# Altium project MC1_LCD.PrjPcb
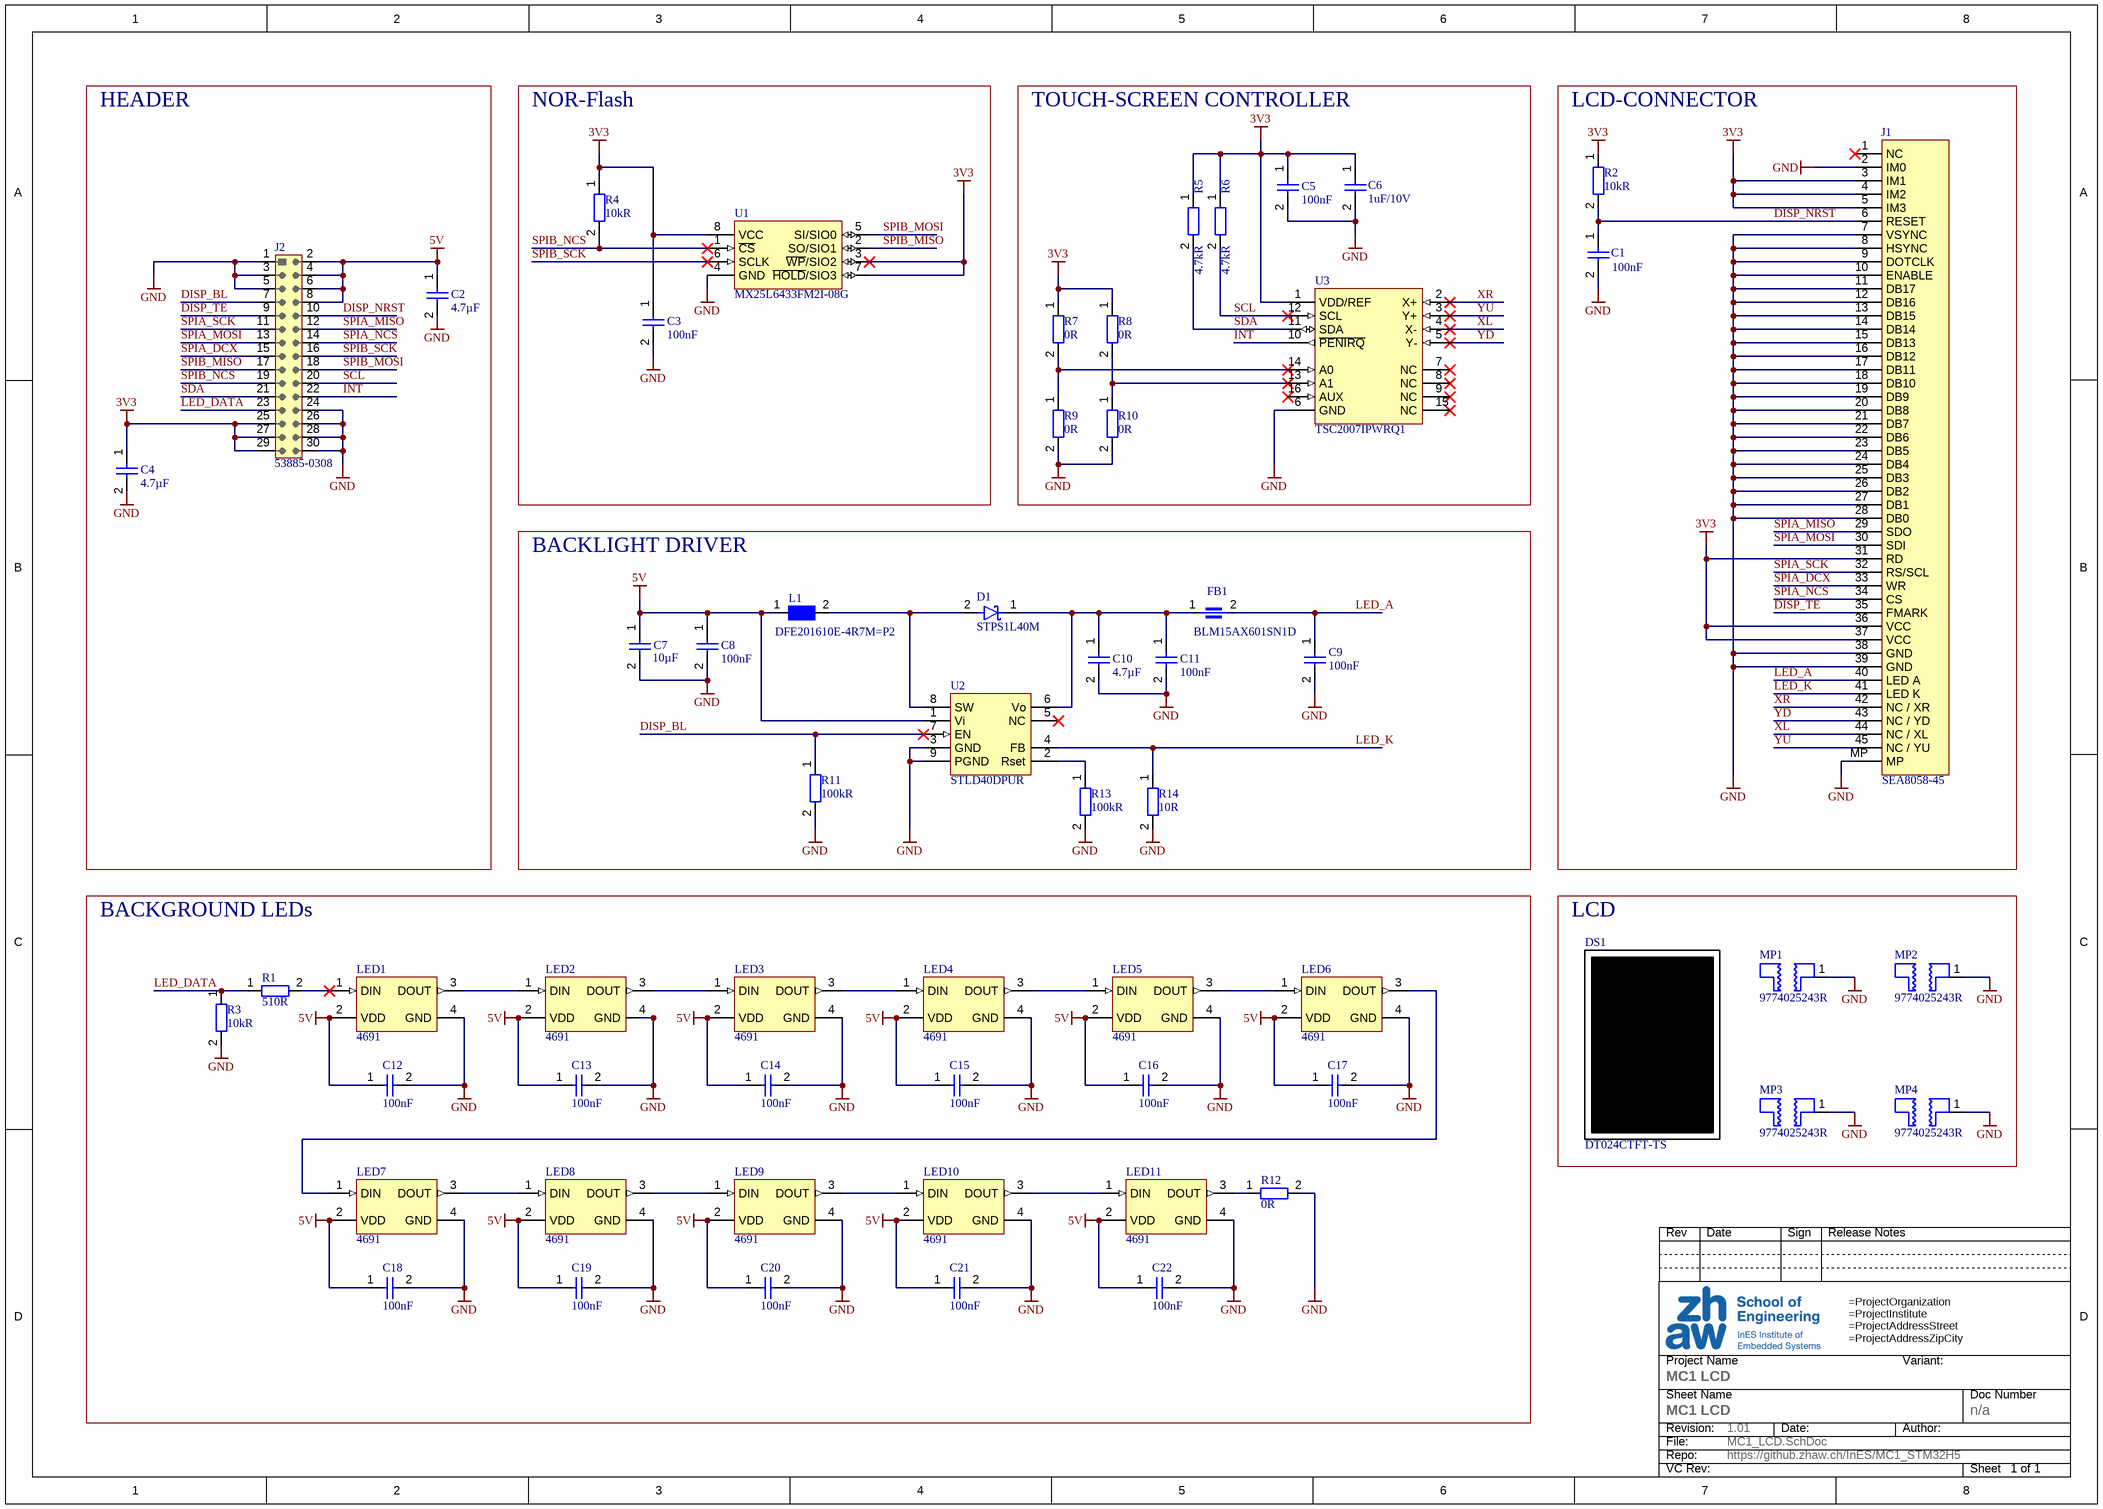
[diagram p0: MC1_LCD.SchDoc]
ProjectAddressStreet: Technikumstrasse 9; ProjectAddressZipCity: CH-8401 Winterthur; ProjectAuthor: frtt; ProjectInstitute: Institute of Embedded Systems; ProjectOrganization: Zurich University of Applied Sciences; ProjectPcbRevision: 1.01; ProjectProjectName: MC1 LCD; ProjectRepository: https://github.zhaw.ch/InES/MC1_STM32H5; ProjectSchematicDate: Can be used to set a manual schematic date. Set the value of the schematic document parameter DocumentDate to =ProjectSchematicDate; ProjectSchematicDocNo: n/a; ProjectSchematicRevision: 1.01; ProjectSchematicSheetNameCommon: Schematic
1 sheet, 60 parts. Net scope: global (net labels, ports and power ports of the same name join across sheets).
Board file: MC1_LCD.PcbDoc

## Sheet MC1_LCD.SchDoc
size A3; SheetNumber: 1; SheetTotal: 1; DocumentSheetName: MC1 LCD; DocumentAuthor: frtt

### Parts
C1  value 100nF  [CAPC1005X05L]  (hidden comment: 100nF/16V)
C2  value 4.7µF  [CAPC1608X80N]  (hidden comment: 4.7uF/16V)
C3  value 100nF  [CAPC1005X05L]  (hidden comment: 100nF/16V)
C4  value 4.7µF  [CAPC1608X80N]  (hidden comment: 4.7uF/16V)
C5  value 100nF  [CAPC1005X05L]  (hidden comment: 100nF/16V)
C6  1uF/10V  [CAPC1005X05L]
C7  value 10µF  [CAPC1608X80N]  (hidden comment: 10uF/10V)
C8  value 100nF  [CAPC1005X50N]  (hidden comment: 100nF/16V)
C9  value 100nF  [CAPC1005X50N]  (hidden comment: 100nF/16V)
C10  value 4.7µF  [CAPC1608X80N]  (hidden comment: 4.7uF/16V)
C11  value 100nF  [CAPC1005X50N]  (hidden comment: 100nF/16V)
C12  value 100nF  [CAPC1005X50N]  (hidden comment: 100nF/16V)
C13  value 100nF  [CAPC1005X50N]  (hidden comment: 100nF/16V)
C14  value 100nF  [CAPC1005X50N]  (hidden comment: 100nF/16V)
C15  value 100nF  [CAPC1005X50N]  (hidden comment: 100nF/16V)
C16  value 100nF  [CAPC1005X50N]  (hidden comment: 100nF/16V)
C17  value 100nF  [CAPC1005X50N]  (hidden comment: 100nF/16V)
C18  value 100nF  [CAPC1005X50N]  (hidden comment: 100nF/16V)
C19  value 100nF  [CAPC1005X50N]  (hidden comment: 100nF/16V)
C20  value 100nF  [CAPC1005X50N]  (hidden comment: 100nF/16V)
C21  value 100nF  [CAPC1005X50N]  (hidden comment: 100nF/16V)
C22  value 100nF  [CAPC1005X50N]  (hidden comment: 100nF/16V)
D1  STPS1L40M  [DIOM190190X100N]
DS1  DT024CTFT-TS  [LCD_DT024CTFT-TS]  (no BOM)
FB1  BLM15AX601SN1D  [INDC1005X05L]
J1  SEA8058-45  [DISPLAYTECH_SEA8058-45]
J2  53885-0308  [MOLEX_53885-0308]
L1  DFE201610E-4R7M=P2  [INDC2016X10L]
LED1  4691  [LED_SK68XX-SIDE]
LED2  4691  [LED_SK68XX-SIDE]
LED3  4691  [LED_SK68XX-SIDE]
LED4  4691  [LED_SK68XX-SIDE]
LED5  4691  [LED_SK68XX-SIDE]
LED6  4691  [LED_SK68XX-SIDE]
LED7  4691  [LED_SK68XX-SIDE]
LED8  4691  [LED_SK68XX-SIDE]
LED9  4691  [LED_SK68XX-SIDE]
LED10  4691  [LED_SK68XX-SIDE]
LED11  4691  [LED_SK68XX-SIDE]
MP1  9774025243R  [WE_9774025243R]
MP2  9774025243R  [WE_9774025243R]
MP3  9774025243R  [WE_9774025243R]
MP4  9774025243R  [WE_9774025243R]
R1  510R  [RESC1005X35N]
R2  10kR  [RESC1005X35N]
R3  10kR  [RESC1005X35N]
R4  10kR  [RESC1005X35N]
R5  4.7kR  [RESC1005X35N]
R6  4.7kR  [RESC1005X35N]
R7  0R  [RESC1005X35N]
R8  0R  [RESC1005X35N]
R9  0R  [RESC1005X35N]
R10  0R  [RESC1005X35N]
R11  100kR  [RESC1005X35N]
R12  0R  [RESC1005X35N]
R13  100kR  [RESC1005X35N]
R14  10R  [RESC1005X35N]
U1  MX25L6433FM2I-08G  [SOP127P800X210-8L]
U2  STLD40DPUR  [QFN65P300X300X100-9T274X190N]
U3  TSC2007IPWRQ1  [TSOP65P640X120-16L]

### Blocks framed on the sheet
HEADER: C2 C4 J2
NOR-Flash: C3 R4 U1
TOUCH-SCREEN CONTROLLER: C5 C6 R5-R10 U3
LCD-CONNECTOR: C1 J1 R2
BACKLIGHT DRIVER: C7-C11 D1 FB1 L1 R11 R13 R14 U2
BACKGROUND LEDs: C12-C22 LED1-LED11 R1 R3 R12
LCD: DS1 MP1-MP4

### Nets
3V3: C3.1 C4.1 C5.1 C6.1 J1.3(IM1) J1.4(IM2) J1.5(IM3) J1.31(RD) J1.36(VCC) J1.37(VCC) J2.25 J2.27 J2.29 R2.1 R4.1 R5.1 R6.1 R7.1 R8.1 U1.3(~{WP}/SIO2) U1.7(~{HOLD}/SIO3) U1.8(VCC) U3.1(VDD/REF)
5V: C2.1 C7.1 C8.1 C12.1 C13.1 C14.1 C15.1 C16.1 C17.1 C18.1 C19.1 C20.1 C21.1 C22.1 J2.2 J2.4 J2.6 J2.8 L1.1 LED1.2(VDD) LED2.2(VDD) LED3.2(VDD) LED4.2(VDD) LED5.2(VDD) LED6.2(VDD) LED7.2(VDD) LED8.2(VDD) LED9.2(VDD) LED10.2(VDD) LED11.2(VDD) U2.1(Vi)
GND: C1.2 C2.2 C3.2 C4.2 C5.2 C6.2 C7.2 C8.2 C9.2 C10.2 C11.2 C12.2 C13.2 C14.2 C15.2 C16.2 C17.2 C18.2 C19.2 C20.2 C21.2 C22.2 J1.2(IM0) J1.7(VSYNC) J1.8(HSYNC) J1.9(DOTCLK) J1.10(ENABLE) J1.11(DB17) J1.12(DB16) J1.13(DB15) J1.14(DB14) J1.15(DB13) J1.16(DB12) J1.17(DB11) J1.18(DB10) J1.19(DB9) J1.20(DB8) J1.21(DB7) J1.22(DB6) J1.23(DB5) J1.24(DB4) J1.25(DB3) J1.26(DB2) J1.27(DB1) J1.28(DB0) J1.38(GND) J1.39(GND) J1.MP J2.1 J2.3 J2.5 J2.24 J2.26 J2.28 J2.30 LED1.4(GND) LED2.4(GND) LED3.4(GND) LED4.4(GND) LED5.4(GND) LED6.4(GND) LED7.4(GND) LED8.4(GND) LED9.4(GND) LED10.4(GND) LED11.4(GND) MP1.1(Pad) MP2.1(Pad) MP3.1(Pad) MP4.1(Pad) R3.2 R9.2 R10.2 R11.2 R12.2 R13.2 R14.2 U1.4(GND) U2.3(GND) U2.9(PGND) U3.6(GND)
DISP_BL: J2.7 R11.1 U2.7(EN)
DISP_NRST: C1.1 J1.6(RESET) J2.10 R2.2
DISP_TE: J1.35(FMARK) J2.9
INT: J2.22 U3.10(~{PENIRQ})
LED_A: C9.1 FB1.2 J1.40(LED_A)
LED_DATA: J2.23 R1.1 R3.1
LED_K: J1.41(LED_K) R14.1 U2.4(FB)
SCL: J2.20 R6.2 U3.12(SCL)
SDA: J2.21 R5.2 U3.11(SDA)
SPIA_DCX: J1.33(WR) J2.15
SPIA_MISO: J1.29(SDO) J2.12
SPIA_MOSI: J1.30(SDI) J2.13
SPIA_NCS: J1.34(CS) J2.14
SPIA_SCK: J1.32(RS/SCL) J2.11
SPIB_MISO: J2.17 U1.2(SO/SIO1)
SPIB_MOSI: J2.18 U1.5(SI/SIO0)
SPIB_NCS: J2.19 R4.2 U1.1(~{CS})
SPIB_SCK: J2.16 U1.6(SCLK)
XL: J1.44(NC_/_XL) U3.4(X-)
XR: J1.42(NC_/_XR) U3.2(X+)
YD: J1.43(NC_/_YD) U3.5(Y-)
YU: J1.45(NC_/_YU) U3.3(Y+)
NetC10_1: C10.1 C11.1 D1.1(Cathode) FB1.1 U2.6(Vo)
NetD1_2: D1.2(Anode) L1.2 U2.8(SW)
NetLED1_1: LED1.1(DIN) R1.2
NetLED1_3: LED1.3(DOUT) LED2.1(DIN)
NetLED2_3: LED2.3(DOUT) LED3.1(DIN)
NetLED3_3: LED3.3(DOUT) LED4.1(DIN)
NetLED4_3: LED4.3(DOUT) LED5.1(DIN)
NetLED5_3: LED5.3(DOUT) LED6.1(DIN)
NetLED6_3: LED6.3(DOUT) LED7.1(DIN)
NetLED7_3: LED7.3(DOUT) LED8.1(DIN)
NetLED8_3: LED8.3(DOUT) LED9.1(DIN)
NetLED9_3: LED9.3(DOUT) LED10.1(DIN)
NetLED10_3: LED10.3(DOUT) LED11.1(DIN)
NetLED11_3: LED11.3(DOUT) R12.1
NetR7_2: R7.2 R9.1 U3.14(A0)
NetR8_2: R8.2 R10.1 U3.13(A1)
NetR13_1: R13.1 U2.2(Rset)

Not connected (* = marked no-connect by the designer): J1 1(NC)*; U2 5(NC)*; U3 7(NC)* 8(NC)* 9(NC)* 15(NC)* 16(AUX)*

### Notes on the sheet
- Rev
- Date
- Sign
- Release Notes
- Sheet Name
- Project Name
- Variant:
- Doc Number
- File:
- Repo:
- Revision:
- Date:
- Author:
- VC Rev:
- Sheet

### Library data of the parts
C1 C3 C5 C8 C9 C11-C22 = CMP-001-00001-22: Cap MLCC, 100nF, 16V, X7R, 5%,  0402; Dielectricum: X7R; Type: MLCC; Case Code (Metric): 1005; Voltage Rating: 16V; Case/Package: 0402; Mounting Technology: SMD; Tolerance: 5%
C2 C4 C10 = CMP-00443-4: Cap MLCC, 4.7uF, 16V, X7R, 10%, 0603; Voltage Rating: 16V; Mounting Technology: SMD; Tolerance: 10%; Case/Package: 0603; Type: MLCC; Case Code (Metric): 1608; Dielectricum: X7R
C6 = CMP-00269-6: CAP MLCC, 1uF, 10V, X7R, 10%, 0402; Value: 1µF; Type: MLCC; Mounting Technology: SMD; Voltage Rating: 10V; Case/Package: 0402; Tolerance: 10%; Case Code (Metric): 1005; Dielectricum: X7R
C7 = CMP-001-00075-19: Cap MLCC, 10uF, 10V, X5R, 10%, 0603; Mounting Technology: SMD; Type: MLCC; Case Code (Metric): 1608; Voltage Rating: 10V; Tolerance: 10%; Dielectricum: X5R; Case/Package: 0603
D1 = CMP-00907-3: Schottky Diode, 40V, 1A, DO-216AA; Size: L1.9B1.9H1; Mounting Technology: SMD; Voltage: 40V; Type: Schottky; Current: 1A; Case/Package: DO-216AA
DS1 = CMP-00784-22: Display, 2.5V..3.3V, 240x320px, Parallel/SPI, Touch: yes, Backlight: yes, FPC-45; Min Supply Voltage: 2.5V; Max Supply Voltage: 3.3V; Mounting Technology: SMD; Interface: Parallel/SPI; Size: L59.46B42.72H3.8; Case/Package: FPC-45; Backlight: yes; Resolution: 240x320; Touch: yes
FB1 = CMP-006-00058-7: Ferrite Bead, 340mR @ DC, 600R @ 100MHz, 25%, 0402, 500mA; Impedance DC: 0.34; Impedance: 600R @ 100 MHz; Tolerance: 25%; Case Code (Metric): 1005; Mounting Technology: SMD; Current: 500mA; Case/Package: 0402
J1 = CMP-00783-14: FFC/FPC, 45 Pin, Pitch 500um, 500mA, Horizontal, SMD, L28B4.2H2; Manufacturer: Displaytech - a SEACOMP company; Connection: Pluggable; Pin Mapping: 1x45; Pitch: 500µm; Gender: Female; Pins: 45; Max Current: 500mA; Angle: Horizontal; Type: FFC/FPC; Mounting Technology: SMD; Size: L28B4.2H2
J2 = CMP-00906-6: Board to Board, SlimStack, 2x15 Pin, Pitch 0.5mm, Male, 0.5A, 50V, Vertical, SMD, L8.95B2.9H1.48; Mating Part: 54102; Manufacturer: Molex; Pitch: 500µm; Max Current: 500mA; Connection: Pluggable; Mounting Technology: SMD; Family Name: SlimStack; Max Voltage: 50V; Gender: Male; Angle: Vertical; Pins: 30; Type: Board to Board; Pin Mapping: 2x15; Size: L8.95B2.92H1.48
L1 = CMP-006-00095-2: Coil, 4.7uH, 1.6A, 288mR, ±20%, 2016; Current: 1.1A; Inductivity: 4.7µH; Resistance DC: 0.288; Case Code (Metric): 2016; Case/Package: 0806; Size: B2L1.6H1; Tolerance: 20%; Mounting Technology: SMD
LED1-LED11 = CMP-00911-8: LED, RGB, 12mA, 5V, 4020, L4B1.5H2, MPN: SK6812-SIDE, Manufacturer: Normand LED, Adafruit Product ID: 4691, NeoPixel; Case/Package: 4020; Mounting Technology: SMD; Size: L4B1.5H2; Rated Current: 12mA; Forward Voltage: 5V; Color: RGB
MP1-MP4 = CMP-00030-00036-1: Standoff M2, SMD, D4.35H2.5, Würth Elektronik WA-SMSI SMT Stell Spacer with internal Thread, Standoff 2.5mm; Mounting Technology: SMD; Size: D4.35H2.5; Case/Package: SMD-1; Type: Standoff
R1 = CMP-009-00498-5: Res, 510R, 1%, 63mW, 0402; Voltage Rating: 50V; Value: 510; Type: Fixed; Case Code (Metric): 1005; Tolerance: 1%; Case/Package: 0402; Mounting Technology: SMD; Power: 63mW
R2-R4 = CMP-009-00298-12: Res, 10kR, 1%, 0.063W, 0402; Value: 10k; Power: 63mW; Voltage Rating: 50V; Tolerance: 1%; Type: Fixed; Case Code (Metric): 1005; Case/Package: 0402; Mounting Technology: SMD
R5 R6 = CMP-009-00030-36: Res, 4.7kR, 1%, 0.1W, 0402; Power: 100mW; Voltage Rating: 50V; Value: 4.7k; Type: Fixed; Case/Package: 0402; Tolerance: 1%; Case Code (Metric): 1005; Mounting Technology: SMD
R7-R10 R12 = CMP-009-00148-34: Res, 0R, 1%, 0.063W, 0402; Value: 0; Power: 63mW; Voltage Rating: 50V; Case/Package: 0402; Tolerance: 1%; Mounting Technology: SMD; Case Code (Metric): 1005; Type: Fixed
R11 R13 = CMP-009-00352-7: Res, 100kR, 1%, 0.063W, 0402; Value: 100k; Voltage Rating: 50V; Power: 63mW; Case Code (Metric): 1005; Type: Fixed; Tolerance: 1%; Mounting Technology: SMD; Case/Package: 0402
R14 = CMP-009-00152-33: Res, 10R, 1%, 0.063W, 0402; Value: 10; Power: 63mW; Voltage Rating: 50V; Type: Fixed; Case Code (Metric): 1005; Mounting Technology: SMD; Case/Package: 0402; Tolerance: 1%
U1 = CMP-00779-6: Flash, 64MBit, SPI, 2.65V..3.6V, SOP-8, NOR-Flash; Min Supply Voltage: 2.65V; Max Supply Voltage: 3.6V; Mounting Technology: SMD; Case/Package: SOP; Size: L5.23B5.28H1.95; Interface: SPI; Memory Size: 64MBit; Technology: NOR-Flash
U2 = CMP-00901-5: LED Driver, 1 Ch, 3..5.5V, Power 3..37V, 1.1Ap, QFN-8; Min Power Voltage: 3V; Max Power Voltage: 37V; Peak Current: 1.1A; Channels: 1; Max Logic Voltage: 5.5V; Case/Package: QFN-8; Size: L35B35H0.9; Function: LED Driver; Min Logic Voltage: 3V; Mounting Technology: SMD
U3 = CMP-00797-5: Interface, Touchscreen-Controller, 20 kHz (8-Bit) or 10 kHz (12-Bit), 1.2V..3.6V, TSSOP-16, I2C; Max Supply Voltage: 3.6V; Min Supply Voltage: 1.2V; Interface Type: Touchscreen-Controller; Specification: 20 kHz (8-Bit) or 10 kHz (12-Bit); Size: L5B4.4H1.2; Mounting Technology: SMD; Case/Package: TSSOP-16

## Assembly variants
Default Assembly: not fitted DS1 R5 R6 R9 R10 R12
Final Assembly: not fitted R5 R6 R9 R10 R12
JLCPCB 2025-10: not fitted DS1 MP1 MP2 MP3 MP4 R5 R6 R9 R10 R12